# EAGLE design stepdrv (EAGLE 6.5.0)
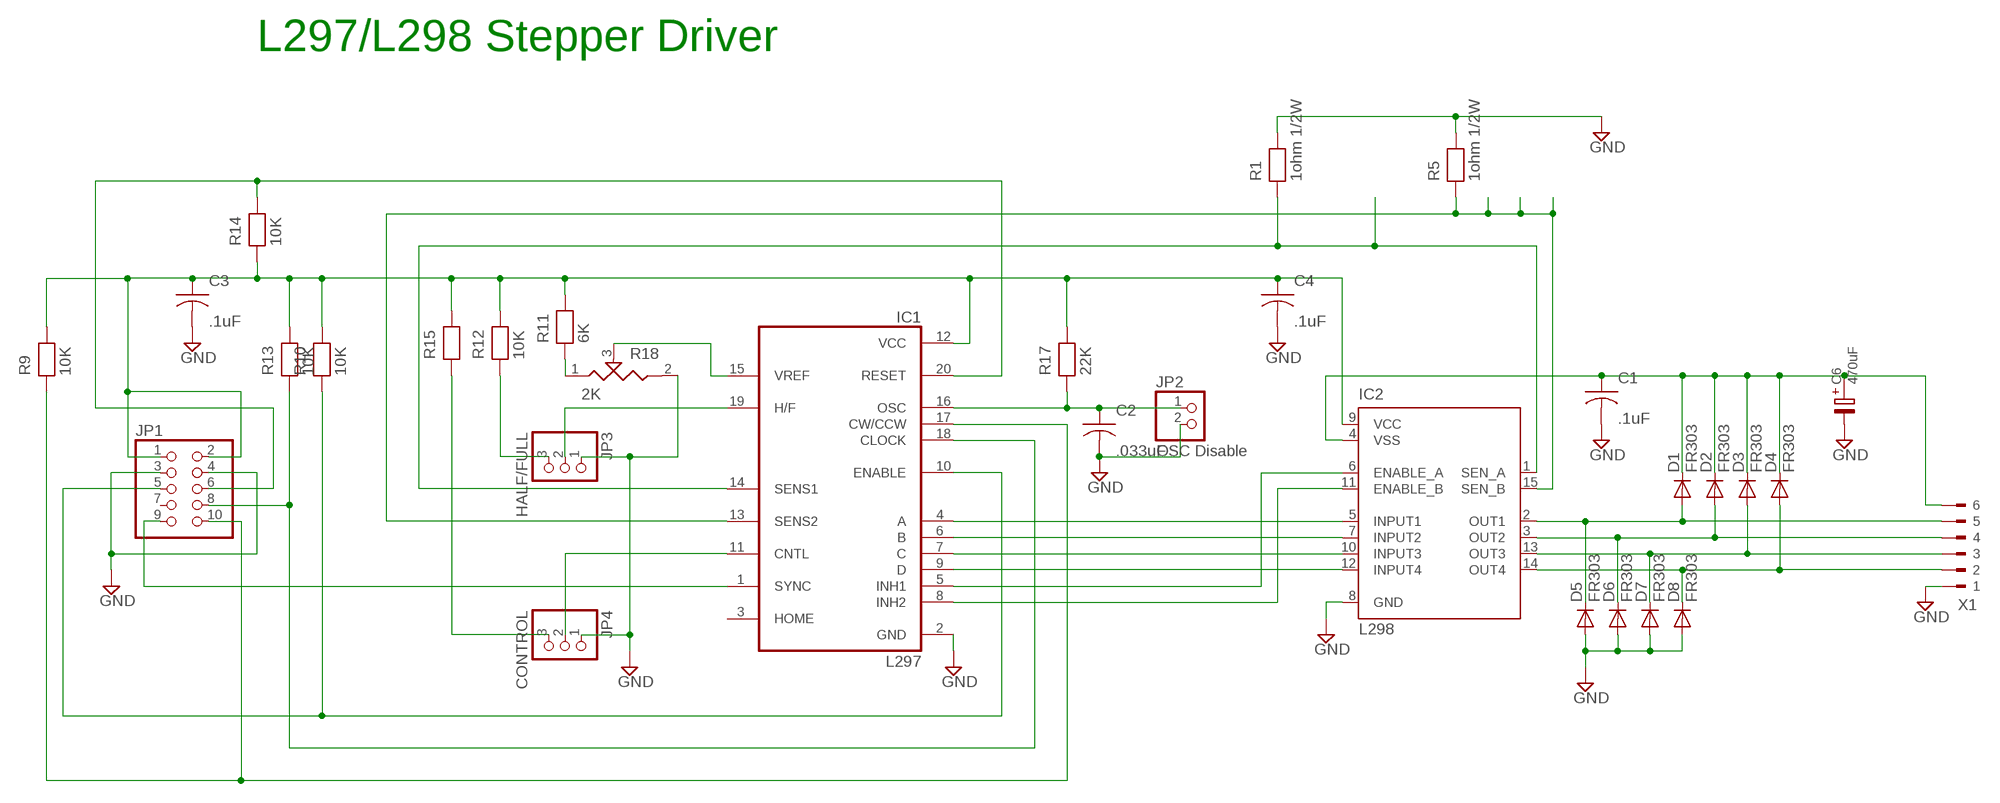
[diagram p0: schematic, sheet 1]

## Parts
C1  .1uF  CAP-5  [C-5]
C2  .033uF  CAP-5  [C-5]
C3  .1uF  CAP-5  [C-5]
C4  .1uF  CAP-5  [C-5]
C6  470uF  E5,0-12  [E5,0-12]
D1  FR303  DIODE-DO201-15  [DO201-15]
D2  FR303  DIODE-DO201-15  [DO201-15]
D3  FR303  DIODE-DO201-15  [DO201-15]
D4  FR303  DIODE-DO201-15  [DO201-15]
D5  FR303  DIODE-DO201-15  [DO201-15]
D6  FR303  DIODE-DO201-15  [DO201-15]
D7  FR303  DIODE-DO201-15  [DO201-15]
D8  FR303  DIODE-DO201-15  [DO201-15]
IC1  L297  [DIL20]
IC2  L298  [MULTIWATT-15]
JP1  PINHD-2X5  [2X05]
JP2  OSC Disable  PINHD-1X2  [1X02]
JP3  HALF/FULL  PINHD-1X3  [1X03]
JP4  CONTROL  PINHD-1X3  [1X03]
R1  1ohm 1/2W  RESEU-12,5  [R-12,5]
R5  1ohm 1/2W  RESEU-12,5  [R-12,5]
R9  10K  RESEU-10  [R-10]
R10  10K  RESEU-10  [R-10]
R11  6K  RESEU-10  [R-10]
R12  10K  RESEU-10  [R-10]
R13  10K  RESEU-10  [R-10]
R14  10K  RESEU-10  [R-10]
R15  RESEU-10  [R-10]
R17  22K  RESEU-10  [R-10]
R18  2K  POTUS-S  [PT-10S]
X1  90-6  [90-6]

## Nets
GND: C1.2 C2.2 C3.2 C4.2 C6.- D5.A D6.A D7.A D8.A IC1.2(GND) IC2.8(GND) JP1.3 JP1.4 JP2.2 JP3.1 JP4.1 R1.2 R5.2 R18.2 X1.1
N$1: D1.A D5.C IC2.2(OUT1) X1.5
N$5: IC1.4(A) IC2.5(INPUT1)
N$6: IC1.6(B) IC2.7(INPUT2)
N$7: IC1.7(C) IC2.10(INPUT3)
N$8: IC1.9(D) IC2.12(INPUT4)
N$9: IC1.14(SENS1) IC2.1(SEN_A) R1.1
N$10: IC1.13(SENS2) IC2.15(SEN_B) R5.1
N$12: IC1.1(SYNC) JP1.9
N$14: IC1.18(CLOCK) JP1.8 R13.1
N$15: IC1.17(CW/CCW) JP1.10 R9.1
N$16: C2.1 IC1.16(OSC) JP2.1 R17.1
N$17: IC1.20(RESET) JP1.6 R14.2
N$19: R11.1 R18.1
N$20: IC1.19(H/F) JP3.2
N$21: IC1.11(CNTL) JP4.2
N$22: IC1.15(VREF) R18.3
N$25: JP3.3 R12.1
N$26: D2.A D6.C IC2.3(OUT2) X1.4
N$27: IC1.5(INH1) IC2.6(ENABLE_A)
N$28: IC1.8(INH2) IC2.11(ENABLE_B)
N$29: D3.A D7.C IC2.13(OUT3) X1.3
N$30: D4.A D8.C IC2.14(OUT4) X1.2
N$40: IC1.10(ENABLE) JP1.5 R10.1
N$42: JP4.3 R15.1
VCC: C3.1 C4.1 IC1.12(VCC) IC2.9(VCC) JP1.1 JP1.2 R9.2 R10.2 R11.2 R12.2 R13.2 R14.1 R15.2 R17.2
VSS: C1.1 C6.+ D1.C D2.C D3.C D4.C IC2.4(VSS) X1.6
Unconnected: IC1.3(HOME) JP1.7

## Notes on the sheet
- L297/L298 Stepper Driver

## Library data of the parts
C1-C4 = discrete:CAP-5
C6 = cap-pan:E5,0-12
D1-D8 = diode:DIODE-: DIODE
IC1 = st-microelectronics:L297: STEPPER MOTOR CONTROLLER
IC2 = st-microelectronics:L298: DUAL FULL-BRIDGE DRIVER
JP1 = pinhead:PINHD-2X5: PIN HEADER
JP2 = pinhead:PINHD-1X2: PIN HEADER
JP3 JP4 = pinhead:PINHD-1X3: PIN HEADER
R1 R5 = discrete:RESEU-12,5
R9-R15 R17 = discrete:RESEU-10
R18 = discrete:POTUS-S
X1 = con-weidmueller-sl35:90-6: WEIDMUELLER CLAMP CONNECTOR

## Board
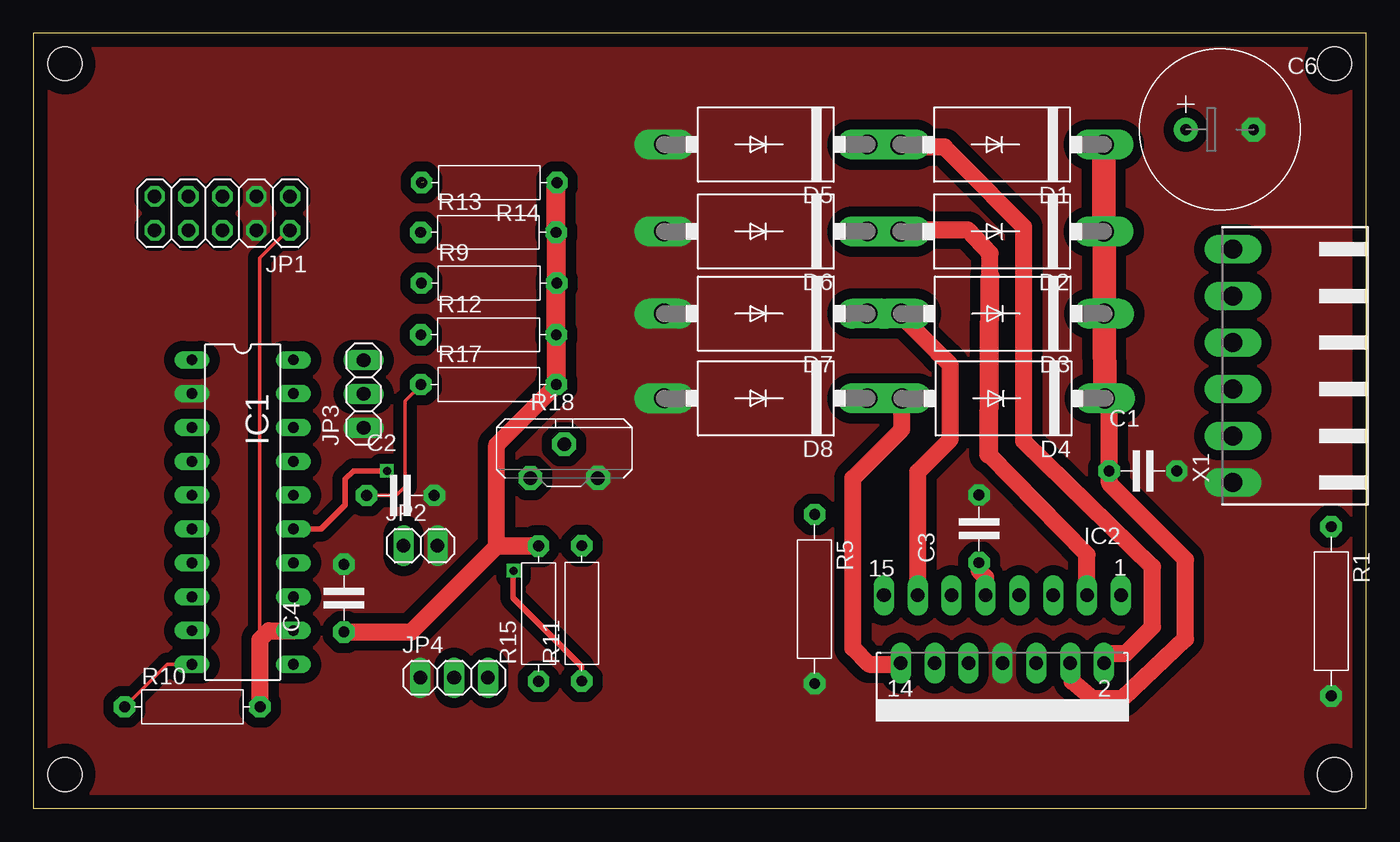
[diagram p1: board, top side]
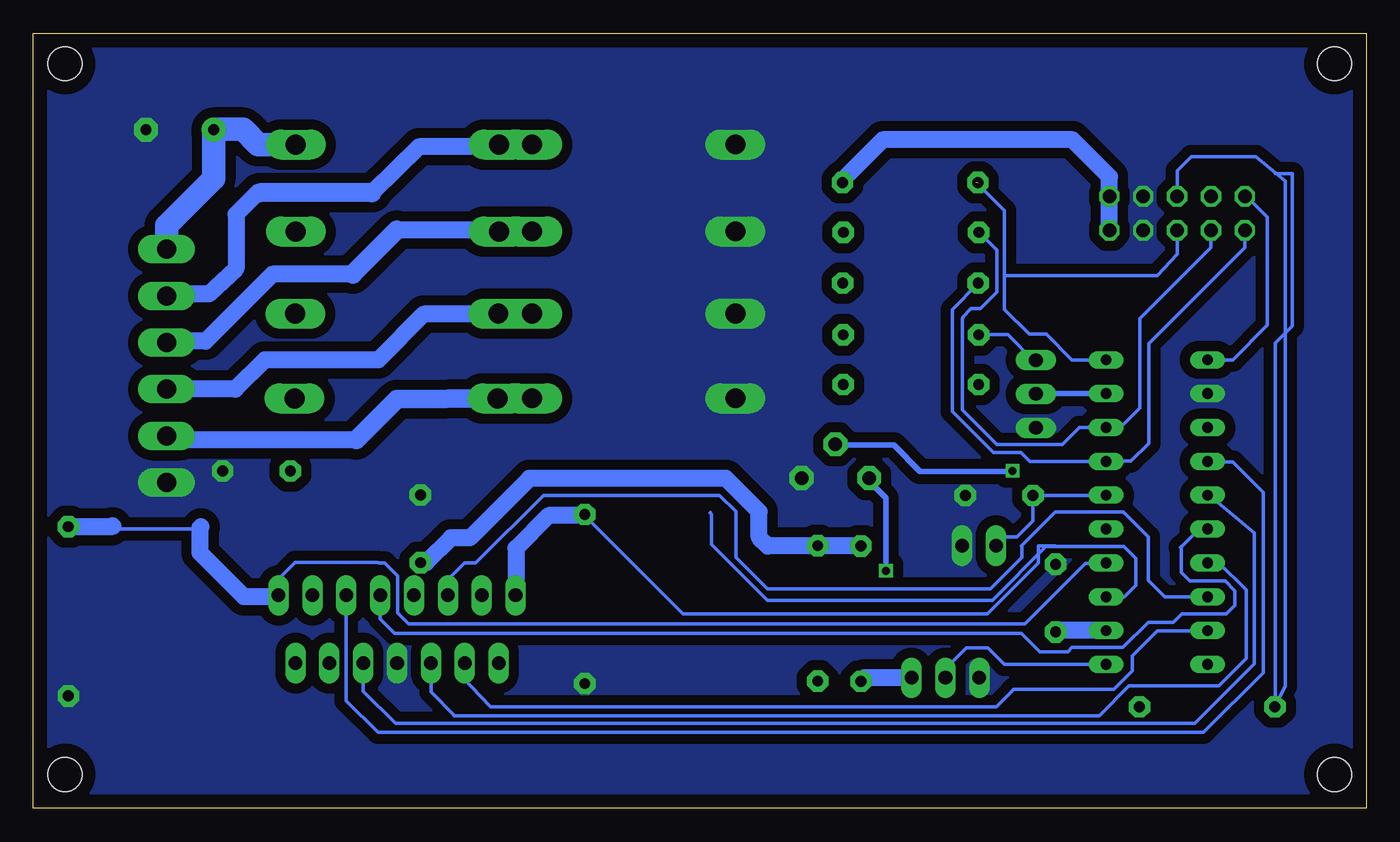
[diagram p2: board, bottom side, seen from below]

Size 100 x 58.16 mm. Coordinates in mm from the lower left corner, seen from the top.
Outline: 0,0 100,0 100,58.16 0,58.16 0,0
Copper layers (1*16): Top 0.035mm / dielectric 1.5mm / Bottom 0.035mm
Design rules "default": minimum track width 10mil, minimum drill 24mil, track to track 8mil, track to pad 8mil, pad to pad 8mil, via to via 8mil, smd to smd 8mil, copper to edge 40mil, drill to drill 8mil, minimum pad ring 10mil, minimum via ring 8mil, stop-mask expansion 4mil, vias tented up to drill 0mil, thermal gap 10mil
Holes 2.54 mm at 2.38,55.88 97.62,55.88 2.38,2.54 97.62,2.54

### Footprints (pad centres in the part's own frame; a part is rotated, then mirrored left to right if it is on the bottom)
C-5 = drill 0.813 pad 1.6 octagon: 1 -2.54,0; 2 2.54,0
E5,0-12 = drill 0.813 pad 1.778: + -2.54,0 | drill 0.813 pad 1.778 octagon: - 2.54,0
DO201-15 = drill 1.499 long: A 7.62,0; C -7.62,0
DIL20 = drill 0.813 long: 1 -11.43,-3.81; 2 -8.89,-3.81; 3 -6.35,-3.81; 4 -3.81,-3.81; 5 -1.27,-3.81; 6 1.27,-3.81; 7 3.81,-3.81; 8 6.35,-3.81; 9 8.89,-3.81; 10 11.43,-3.81; 11 11.43,3.81; 12 8.89,3.81; 13 6.35,3.81; 14 3.81,3.81; 15 1.27,3.81; 16 -1.27,3.81; 17 -3.81,3.81; 18 -6.35,3.81; 19 -8.89,3.81; 20 -11.43,3.81
MULTIWATT-15 = drill 1.016 long: 1 -8.89,-7.62; 2 -7.62,-2.54; 3 -6.35,-7.62; 4 -5.08,-2.54; 5 -3.81,-7.62; 6 -2.54,-2.54; 7 -1.27,-7.62; 8 0,-2.54; 9 1.27,-7.62; 10 2.54,-2.54; 11 3.81,-7.62; 12 5.08,-2.54; 13 6.35,-7.62; 14 7.62,-2.54; 15 8.89,-7.62
2X05 = drill 1.016 octagon: 1 -5.08,-1.27; 2 -5.08,1.27; 3 -2.54,-1.27; 4 -2.54,1.27; 5 0,-1.27; 6 0,1.27; 7 2.54,-1.27; 8 2.54,1.27; 9 5.08,-1.27; 10 5.08,1.27
1X02 = drill 1.016 long: 1 -1.27,0; 2 1.27,0
1X03 = drill 1.016 long: 1 -2.54,0; 2 0,0; 3 2.54,0
R-12,5 = drill 0.813 pad 1.6 octagon: 1 -6.35,0; 2 6.35,0
R-10 = drill 0.813 pad 1.6 octagon: 1 -5.08,0; 2 5.08,0
PT-10S = drill 1.016 pad 1.778 octagon: 1 -2.54,-1.27; 2 2.54,-1.27; 3 0,1.27
90-6 = drill 1.422 long: 1 -8.75,5.25; 2 -5.25,5.25; 3 -1.75,5.25; 4 1.75,5.25; 5 5.25,5.25; 6 8.75,5.25

### Placement (x,y rotation side)
C1  83.26,25.31 0 top
C2  27.54,23.47 0 top
C3  70.95,20.98 90 top
C4  23.3,15.77 90 top
C6  89.01,50.93 0 top
D1  72.68,49.81 180 top
D2  72.68,43.29 180 top
D3  72.73,37.11 180 top
D4  72.78,30.76 180 top
D5  54.95,49.82 180 top
D6  54.95,43.29 180 top
D7  54.95,37.12 180 top
D8  54.95,30.77 180 top
IC1  15.71,22.22 270 top
IC2  72.71,8.36 180 top
JP1  14.18,44.64 180 top
JP2  29.05,19.71 0 top
JP3  24.78,31.09 90 top
JP4  31.57,9.79 0 top
R1  97.37,14.78 270 top
R5  58.62,15.71 270 top
R9  34.19,39.41 0 top
R10  11.93,7.62 0 top
R11  41.15,14.62 90 top
R12  34.15,35.53 0 top
R13  34.15,43.22 0 top
R14  34.21,46.96 180 top
R15  37.91,14.6 90 top
R17  34.16,31.8 0 top
R18  39.82,26.05 0 top
X1  95.25,33.2 90 top

### Tracks (layer width: path | path; a pad name or v marks a point on that pad's centre or on a via)
GND
  pour Top (isolate 0.762, no thermals): 0.85,57.27 99.15,57.27 99.15,57.15 99.28,57.15 99.28,0.76 0.85,0.76
  pour Bottom (isolate 0.762, no thermals): 0.85,57.27 99.28,57.27 99.28,0.76 0.98,0.76 0.98,0.88 0.85,0.88
N$1
  Top 0.813: 65.3,49.63 65.3,49.84 65.24,49.91 65.11,49.78 D1.A
  Top 1.27: IC2.2 80.44,11.66 80.47,11.63 81.97,11.63 83.97,13.63 83.95,13.63 | D1.A 65.03,49.81 64.99,49.86 64.95,49.82 D5.C | 68.36,49.63 69.57,48.41 74.3,43.63 74.3,27.54 83.97,18.13 83.97,13.65 83.95,13.63 | 68.36,49.63 65.3,49.63 | 68.36,49.63 | 83.95,13.63 83.91,13.58
  Bottom 0.254: 63.97,49.63 63.97,50.16 D1.A
  Bottom 1.27: 74.59,46.18 71.06,49.64 65.25,49.64 65.11,49.63 65.06,49.63 64.88,49.8 64.88,49.88 64.76,50.01 62.88,50.01 62.83,49.96 62.78,49.96 62.6,49.78 62.6,49.63 63.97,49.63 64.81,49.63 64.99,49.45 65.01,49.45 65.04,49.47 65.62,49.47 | 83.02,46.18 83.15,46.22 84.8,44.57 84.8,40.51 86.83,38.6 90,38.6 90.16,38.45 | 90.16,38.45 90.26,38.35 | 90.16,38.45 X1.5
  Bottom 1.422: 74.59,46.18 83.02,46.18
N$5
  Bottom 0.254: IC2.5 76.52,8.07 74.13,5.68 12.21,5.68 7.71,10.18 7.71,23.69 10.02,26 11.95,26 11.92,26.03 IC1.4
N$6
  Bottom 0.254: IC1.6 12.53,20.95 13.83,19.65 13.86,19.65 13.93,19.58 13.86,19.5 13.86,17.7 13.22,17.06 10.58,17.06 9.84,16.33 9.84,15.24 10.48,14.6 13.83,14.6 14.46,13.97 16.34,13.97 18.25,12.06 22.08,12.06 22.39,11.76 24.5,11.76 25.87,13.13 72.91,13.13 73.98,14.19 IC2.7
N$7
  Bottom 0.254: IC2.10 70.17,8.73 68.39,6.96 | 11.97,18.41 12.03,18.36 | 11.97,18.41 IC1.7 | 11.97,18.41 11.9,18.49 11.11,18.49 9,16.38 9,11.25 11.06,9.19 17.79,9.19 20.03,6.96 68.39,6.96 | 68.39,6.96 68.41,6.93
N$8
  Bottom 0.254: 65.7,7.62 67.14,9.14 67.63,9.67 IC2.12 | 11.9,13.25 11.85,13.2 | 11.9,13.25 IC1.9 | 11.9,13.25 11.95,13.31 15.69,13.31 17.54,11.45 17.54,10.31 18.94,8.91 26.48,8.91 26.58,8.81 26.58,8.78 27.75,7.62 65.7,7.62 | 65.7,7.62 65.72,7.64
N$9
  Bottom 0.254: IC2.1 81.6,17.22 80.35,18.46 74.16,18.46 74.11,18.41 73.65,18.41 72.68,17.45 72.68,14.68 71.84,13.84 25.62,13.84 21.07,18.38 19.54,18.38 19.52,18.36 | 19.52,18.36 19.49,18.33 | 19.52,18.36 IC1.14 | 87.49,20.95 94.45,20.95 94.15,21.13
  Bottom 1.27: 94.04,21.18 94.07,21.2 94.15,21.13 R1.1 | 87.41,21.13 87.49,21.06 87.49,20.95 87.49,19.17 84.19,15.87 81.83,15.87 81.62,16.07 81.6,16.05 IC2.1
N$10
  Bottom 0.254: IC1.13 18.14,15.87 17.29,16.73 17.29,18.77 18.17,19.65 23.33,19.65 | 49.19,22.19 49.21,22.17 49.11,22.07 49.11,19.81 44.92,15.62 28.05,15.62 24.02,19.65 23.33,19.65 | R5.1 58.89,22.22 51.27,14.6 28.41,14.6 24.6,18.41 24.6,19.68 23.33,19.68 23.33,19.65
  Bottom 1.27: R5.1 58.72,22.06 58.81,21.97 61.33,21.97 63.79,19.5 63.79,16.02 63.75,15.98 | 63.75,15.98 63.72,15.95 | 63.75,15.98 IC2.15
N$12
  Bottom 0.254: JP1.9 8.94,45.91 7.4,44.37 7.4,36.27 10.02,33.65 11.95,33.65 IC1.1
N$14  (1 unrouted)
  Bottom 0.254: 29.07,43.25 27.7,41.88 27.7,38.73 28.94,37.48 29.65,37.48 30.26,36.88 30.26,36.77 30.29,36.75 30.29,29.89 27.7,27.3 22.8,27.3 21.52,28.57 IC1.18 19.44,28.49 18.53,28.49 16.98,30.04 16.98,36.75 11.64,42.09 JP1.8
N$15
  Bottom 0.254: R9.1 29.11,39.37 31.05,37.44 31.05,29.79 27.95,26.69 25.89,26.69 25.24,26.03 IC1.17 19.46,25.97 | JP1.10 9.1,42.09 16.32,34.87 16.32,27.38 17.64,26.05 19.37,26.05 19.46,25.97 | 19.49,25.93 19.46,25.97
N$16
  Top 0.254: C2.1 27.22,23.47 27.9,24.15 27.9,30.55 29.1,31.74 29.08,31.76 R17.1
  Bottom 0.254: 19.31,23.49 19.29,23.52 | 19.31,23.49 IC1.16 | 19.31,23.49 19.33,23.47 C2.1 25,21.57 26.2,20.37 27.77,20.37 JP2.1 | JP2.1 27.77,19.53 | JP2.1
N$17  (1 unrouted)
  Bottom 0.254: IC1.20 22.06,33.65 23.99,35.58 25.29,35.58 27.14,37.44 27.14,39.98 | 29.27,46.98 27.14,44.85 27.14,40.03 27.14,39.98 | JP1.6 14.18,41.58 15.69,39.98 27.14,39.98
N$19  (via drill 0.61)
  Top 0.406: R11.1 41.14,10.65 36,15.79 36,17.8 v36.03,17.83
  Bottom 0.406: R18.1 37.28,24.67 37.35,24.61 36.03,23.29 v36.03,17.83
N$20
  Bottom 0.406: 24.89,31.09 25.03,30.96 | 24.89,31.09 JP3.2 | IC1.19 24.88,31.11 24.89,31.09
N$21
  Bottom 0.254: IC1.11 27.14,10.79 28.38,12.04 30.01,12.04 31.53,10.51 31.53,9.9 31.58,9.85 31.57,9.83 JP4.2
N$22  (via drill 0.61)
  Top 0.406: IC1.15 21.58,20.95 23.41,22.78 23.41,24.71 24.02,25.32 v26.53,25.32
  Bottom 0.406: v26.53,25.32 26.61,25.32 26.63,25.29 33.46,25.29 35.45,27.27 39.84,27.27 39.89,27.32 | 39.89,27.32 | 39.89,27.32 R18.3
N$25
  Bottom 0.254: JP3.3 24.88,33.52 26.89,35.53 R12.1
N$26
  Top 0.254: D2.A 65.24,43.81 65.24,43.38
  Top 1.27: 71.68,26.55 79.06,19.04 79.06,16.02 79.08,16 IC2.3 | 71.78,39.93 71.78,41.64 70.12,43.4 65.24,43.38 65.09,43.38 | 65.1,43.29 65.11,43.28 | D2.A 65.1,43.29 | 65.1,43.29
  Top 1.422: 71.68,26.55 71.78,39.93
  Bottom 0.254: D2.A 65.24,43.81 65.09,43.38
  Bottom 1.27: 76.03,40.09 82.05,40.09 87.08,35.05 89.88,35.05 90,34.93 | 90,34.93 90,34.92 | 90,34.93 X1.4 | 72.73,43.39 65.2,43.39 65.04,43.23 65.09,43.38 | 65.01,43.29 65.01,43.28 | 65.01,43.29 D2.A | D6.C 65.01,43.29
  Bottom 1.422: 72.73,43.39 76.03,40.09
N$27
  Bottom 0.254: IC2.6 75.25,8.78 72.83,6.37 12.87,6.37 8.39,10.84 8.39,20.67 11.85,23.57 11.9,23.52 IC1.5
N$28
  Bottom 0.254: IC2.11 68.9,17.16 67.65,18.41 66.81,18.41 61.73,23.49 48.5,23.49 47.28,22.27 47.28,18.84 44.92,16.48 28.21,16.48 25.84,18.84 25.84,19.68 | IC1.8 15.1,15.87 16.34,17.11 16.34,20.37 18.22,22.24 23.33,22.24 25.82,19.73 25.87,19.68 25.84,19.68 | 25.82,19.7 25.84,19.68
N$29
  Top 1.27: D7.C 65.07,37.12 65.11,37.08 D3.A 65.11,36.95 67.8,34.26 68.8,33.29 68.8,27.68 66.36,25.24 IC2.13
  Bottom 1.27: X1.3 84.84,31.45 82.64,33.65 74.13,33.65 70.7,37.08 65.11,37.08 D3.A
N$30
  Top 1.27: D8.C 62.57,30.6 62.66,30.69 D4.A 65.16,28.44 61.48,24.76 61.48,12.04 62.7,10.82 65.01,10.82 IC2.14 65.09,11.07
  Bottom 1.27: X1.2 89.71,27.64 75.78,27.64
  Bottom 1.422: 75.78,27.64 72.73,30.69 D4.A
N$40
  Top 0.254: R10.1 6.87,7.62 10.05,10.79 IC1.10
  Bottom 0.254: JP1.5 14.18,47.85 13.12,48.91 8.29,48.91 6.79,47.66 | 6.79,47.66 6.08,47.06 6.08,9.16 6.87,7.67 | R10.1 6.82,8.25 6.82,34.92 5.55,36.19 5.55,47.62 6.82,47.62 6.79,47.66
N$42
  Bottom 1.27: JP4.3 37.64,9.79 R15.1
VCC
  Top 0.254: JP1.2 19.52,43.81 16.98,41.27 16.98,13.33 17.32,12.99
  Top 1.27: C3.1 70.95,17.83 71.44,17.34 71.44,16.12 71.41,16.1 71.44,16.07 IC2.9 | C4.1 28.36,13.23 34.81,19.68 37.78,19.68 37.83,19.73 37.88,19.68 R15.2 34.76,19.68 34.76,27.27 39.24,31.75 R17.2 | R10.2 17.01,12.67 17.32,12.99 17.67,13.33 19.47,13.33 19.49,13.31 IC1.12
  Top 1.422: R17.2 39.24,35.42 39.2,35.45 39.23,35.48 R12.2 39.23,39.19 39.36,39.31 39.27,39.4 R9.2 39.27,42.98 39.15,43.1 39.23,43.17 R13.2 39.23,46.88 39.29,46.95 R14.1
  Bottom 1.27: C3.1 70.52,18.43 68.67,20.29 67.25,20.29 62.78,24.76 48.04,24.76 45.55,22.27 45.55,20.34 44.89,19.68 41.24,19.68 41.21,19.7 R11.2 37.83,19.7 | 37.83,19.7 37.86,19.68 R15.2 | 37.83,19.7 37.73,19.81 | C4.1 23.3,13.2 23.17,13.33 IC1.12 | JP1.1 19.26,43.61 19.37,43.51 19.26,43.4 JP1.2 19.26,47.39 22.04,50.16 36.26,50.16 39.28,47.14
VSS
  Top 1.27: D1.C 80.35,43.68 80.3,43.63 80.35,43.58 D2.C 80.35,37.18 80.3,37.13 | 80.3,37.13 80.35,37.08 D3.C | 80.35,36.58 80.3,36.63 80.3,37.13 | 80.73,25.31 C1.1 | D4.C 80.73,30.69 80.73,25.31 | 80.73,25.31 80.73,24.38 86.45,18.66 86.45,12.7 81.75,8.25 79.46,8.25 77.94,9.52 77.94,10.79 77.81,10.92 IC2.4
  Top 1.778: D4.C 80.35,36.58 | 80.35,37.18 D1.C
  Bottom 1.27: 86.45,50.95 C6.+ 86.47,50.77 86.53,50.72 86.47,50.67
  Bottom 1.778: D1.C 83.13,49.81 84.27,50.95 86.45,50.95 | X1.6 90,43.71 86.47,47.24 86.47,50.67